# EAGLE schematic Roomsensor (EAGLE 7.5.0)
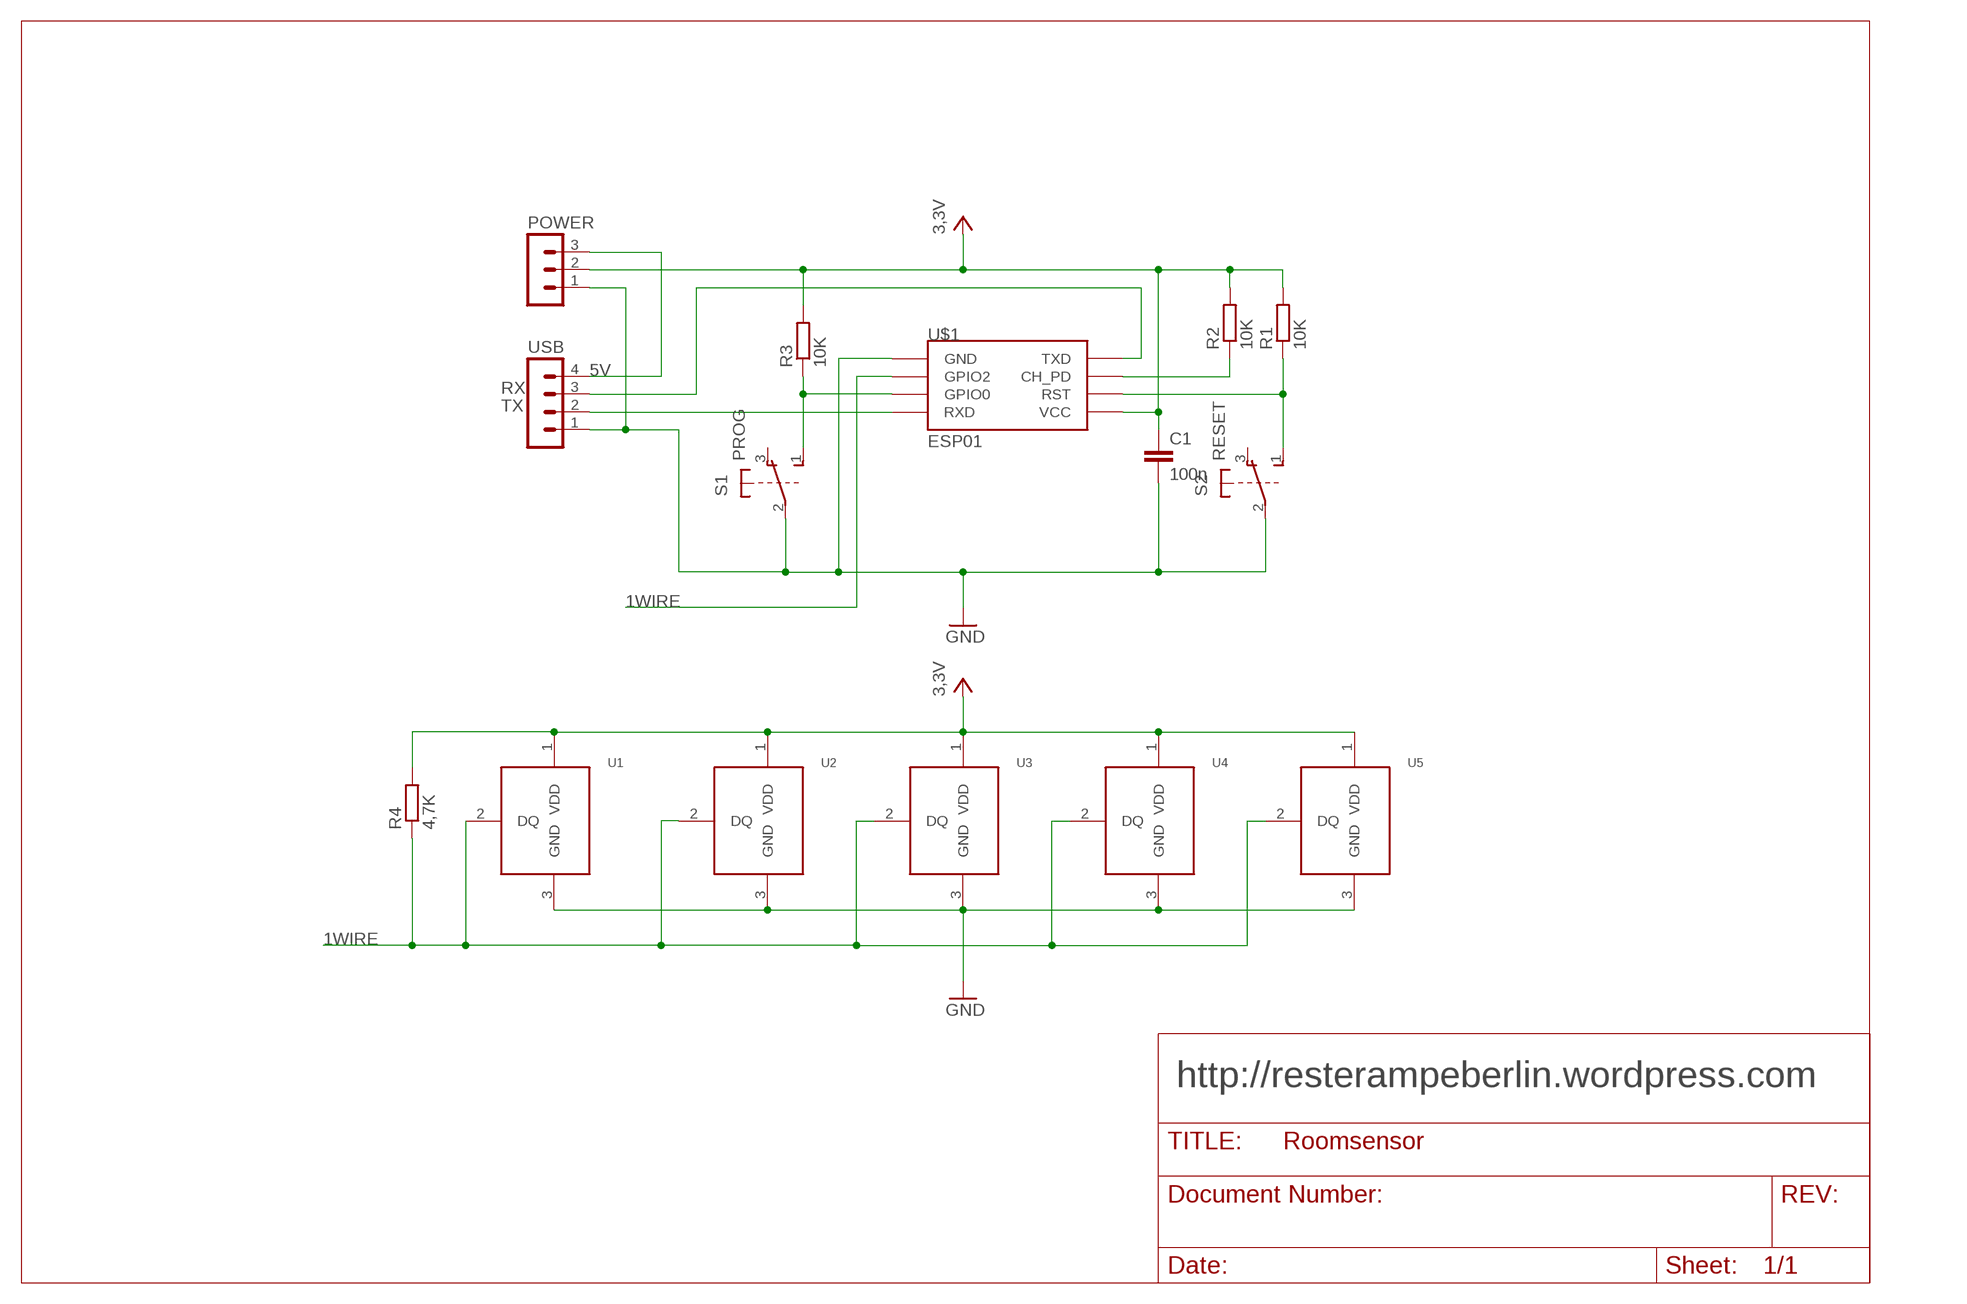
[diagram p0: schematic, sheet 1]

## Parts
C1  100n  C5/3  [C5B3]
POWER  MA03-1  [MA03-1]
R1  10K  R-EU_0207/10  [0207/10]
R2  10K  R-EU_0207/10  [0207/10]
R3  10K  R-EU_0207/10  [0207/10]
R4  4,7K  R-EU_0207/10  [0207/10]
S1  PROG  9077-2  [9077-2]
S2  RESET  9077-2  [9077-2]
U1  18S20  [TO-92]
U2  18S20  [TO-92]
U3  18S20  [TO-92]
U4  18S20  [TO-92]
U5  18S20  [TO-92]
U$1  ESP01  [ESP01]
USB  MA04-1  [MA04-1]

## Nets
1WIRE: R4.1 U1.2(DQ) U2.2(DQ) U3.2(DQ) U4.2(DQ) U5.2(DQ) U$1.GPIO2
5V: POWER.3 USB.4
GND: C1.2 POWER.1 S1.2(1:P) S2.2(1:P) U1.3(GND) U2.3(GND) U3.3(GND) U4.3(GND) U5.3(GND) U$1.GND USB.1
N$3: R1.1 S2.1(1:S) U$1.RST
N$4: R3.1 S1.1(1:S) U$1.GPIO0
N$7: R2.1 U$1.CH_PD
N$8: U$1.RX(RXD) USB.2
N$9: U$1.TX(TXD) USB.3
VCC: C1.1 POWER.2 R1.2 R2.2 R3.2 R4.2 U1.1(VDD) U2.1(VDD) U3.1(VDD) U4.1(VDD) U5.1(VDD) U$1.VCC ; supply symbol labelled 3,3V
Unconnected: S1.3(1:O) S1.4(2:S) S1.5(2:P) S1.6(2:O) S2.3(1:O) S2.4(2:S) S2.5(2:P) S2.6(2:O)

## Notes on the sheet
- RX
- TX
- http://resterampeberlin.wordpress.com

## Library data of the parts
C1 = capacitor-wima:C: CAPACITOR naming: grid - package width
POWER = con-lstb:MA03-1: PIN HEADER; OC_FARNELL: unknown; OC_NEWARK: unknown
R1-R4 = resistor:R-EU_: RESISTOR, European symbol
S1 S2 = switch-misc:9077-2: MARQUARDT SWITCH 9077.0200 Distributor: Buerklin <https://www.buerklin.com/default.asp?event=ShowArtikel%2812G2822%29&l=d&jump=ArtNr_12G2822>
U1-U5 = merriman:18S20: Dallas/Maxim 18S20 1-Wire temperature sensor (including PAR, since assumes pin 3 NOT connected internally on that variant)
U$1 = esp8266modules:ESP01: ESP8266 Wifi module 01
USB = con-lstb:MA04-1: PIN HEADER; OC_FARNELL: unknown; OC_NEWARK: unknown